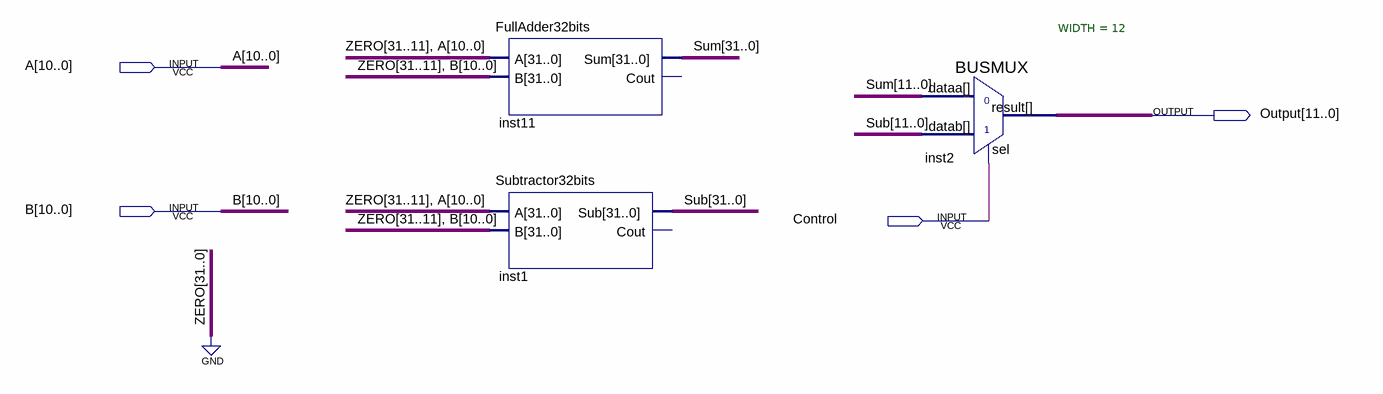
[diagram p0: schematic sheet]
// Quartus schematic Significant_Add_Sub.bdf as structural Verilog: 3 symbols, 4 pins
module Significant_Add_Sub (
  input  [10:0] A,
  input  [10:0] B,
  input  Control,
  output [11:0] Output
);

  wire [31:0] Sub, Sum;

  FullAdder32bits inst11 (.A({{21{1'b0}}, A}), .B({{21{1'b0}}, B}), .Sum(Sum));  // open: Cout
  Subtractor32bits inst1 (.A({{21{1'b0}}, A}), .B({{21{1'b0}}, B}), .Sub(Sub));  // open: Cout
  BUSMUX #(.WIDTH(12)) inst2 (.datab(Sub[11:0]), .sel(Control), .dataa(Sum[11:0]), .result(Output));
endmodule
